# Altium schematic sheet Panorama.SchDoc
size A4; SheetNumber: 4; SheetTotal: 4
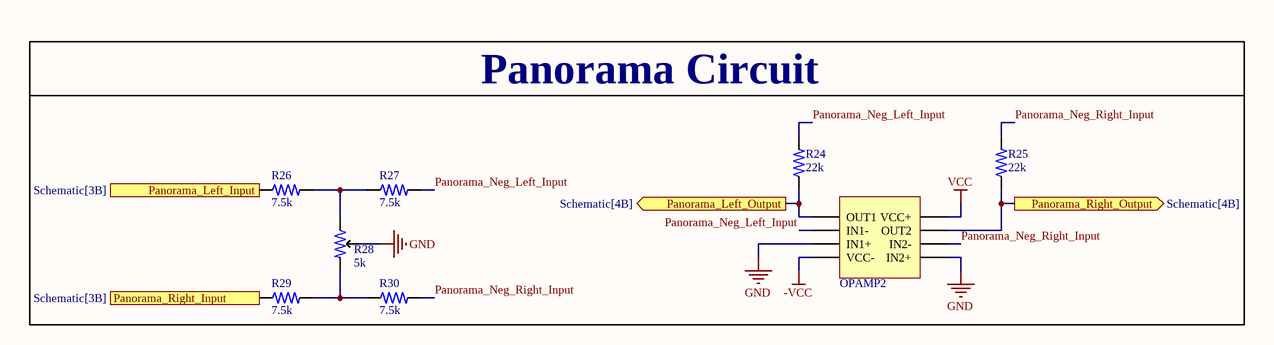
[diagram p0: Panorama.SchDoc]

## Parts
OPAMP2  TL072  [DIP8]  (value not drawn)
R24  22k  [RES0603]
R25  22k  [RES0603]
R26  7.5k  [RES0603]
R27  7.5k  [RES0603]
R28  5k  [Potentiometer THT]
R29  7.5k  [RES0603]
R30  7.5k  [RES0603]

## Ports
Panorama_Left_Input (in, see Schematic[3B]), Panorama_Left_Output (out, see Schematic[4B]), Panorama_Right_Input (in, see Schematic[3B]), Panorama_Right_Output (out, see Schematic[4B])

## Nets
-VCC: OPAMP2.4(VCC-)
GND: OPAMP2.3(IN1+) OPAMP2.5(IN2+) R28.3
VCC: OPAMP2.8(VCC+)
Panorama_Left_Input: R26.1 ; port Panorama_Left_Input
Panorama_Left_Output: OPAMP2.1(OUT1) R24.1 ; port Panorama_Left_Output
Panorama_Neg_Left_Input: OPAMP2.2(IN1-) R24.2 R27.2
Panorama_Neg_Right_Input: OPAMP2.6(IN2-) R25.2 R30.2
Panorama_Right_Input: R29.1 ; port Panorama_Right_Input
Panorama_Right_Output: OPAMP2.7(OUT2) R25.1 ; port Panorama_Right_Output
NetR26_2: R26.2 R27.1 R28.1
NetR28_2: R28.2 R29.2 R30.1

## Notes on the sheet
- Panorama Circuit

## Library data of the parts
R24-R27 R29 R30 = RESISTOR SMD: MP: 3-1879460-6; Package: None; Price: None; Value: *; Availability: Unavailable
R28 = Potentiometer